# Altium schematic sheet Voltage detect.SchDoc
size A4; ENG_APP_DATE: --/--/--; DSN_APP_DATE: --/--/--; CHK_APP_DATE: --/--/--
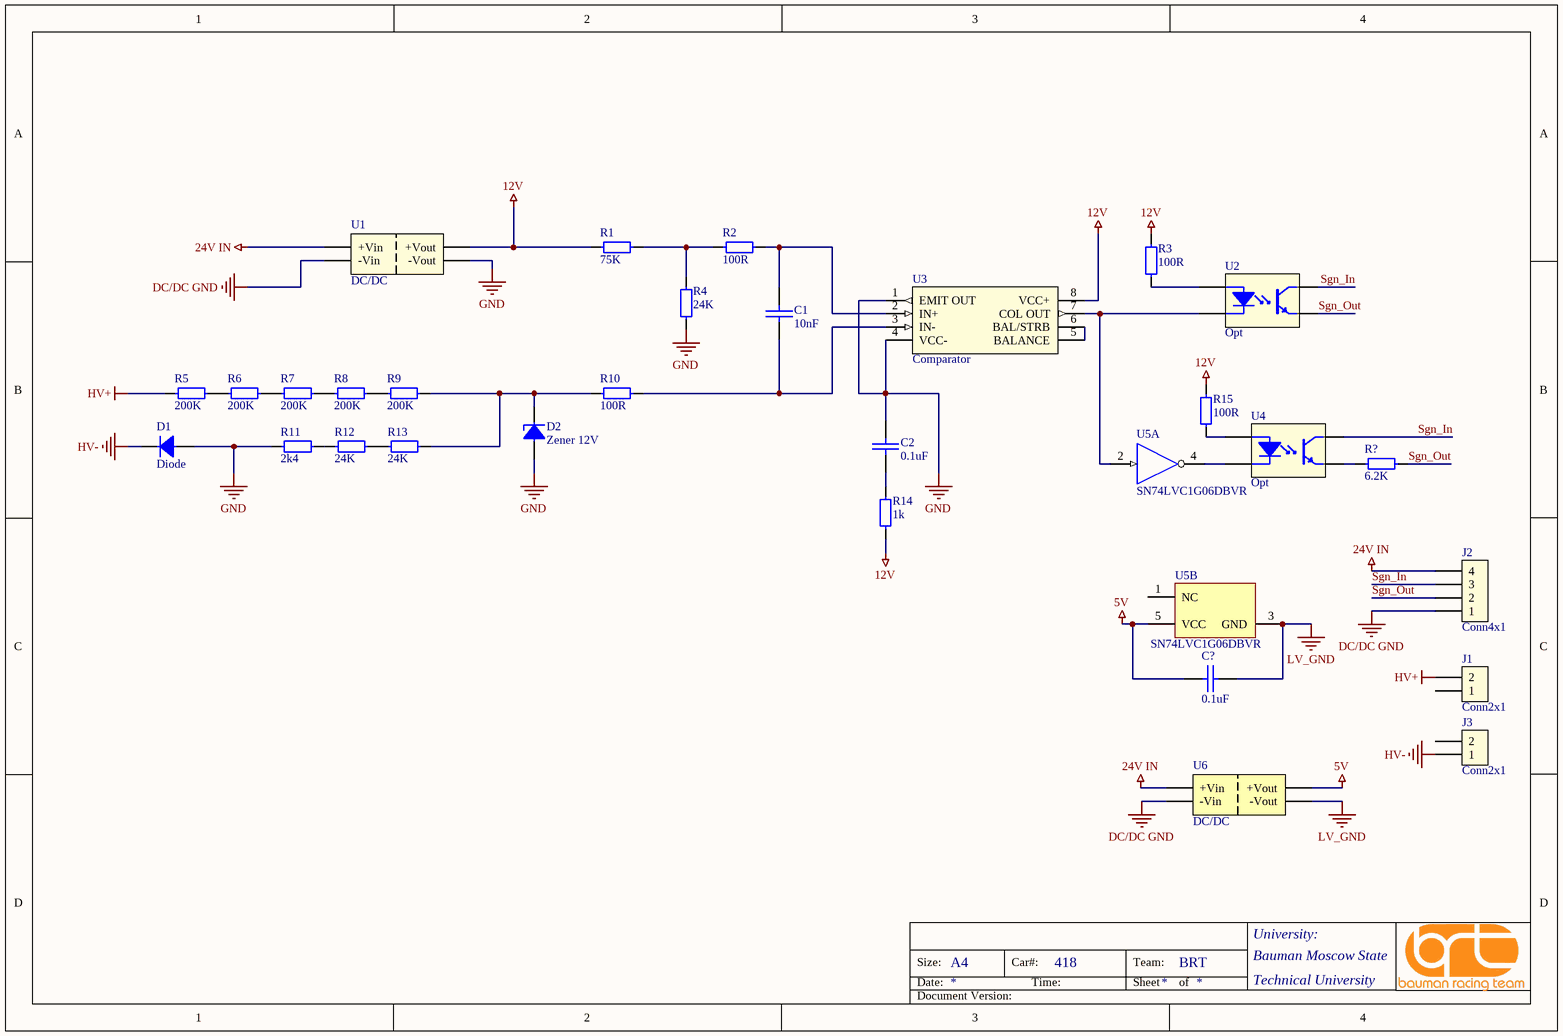
[diagram p0: Voltage detect.SchDoc]

## Parts
C1  10nF  [0805 Capicator]
C2  0.1uF  [0805 Capicator]
C?  0.1uF  [0805 Capicator]
D1  Diode  [BY12]
D2  Zener 12V  [sod-323]
J1  Conn2x1  [MolexMicroFit 2x1]
J2  Conn4x1  [MolexMicroFit 4x1]
J3  Conn2x1  [MolexMicroFit 2x1]
R1  75K  [0805 Resistor]
R2  100R  [0805 Resistor]
R3  100R  [0805 Resistor]
R4  24K  [0805 Resistor]
R5  200K  [0805 Resistor]
R6  200K  [0805 Resistor]
R7  200K  [0805 Resistor]
R8  200K  [0805 Resistor]
R9  200K  [0805 Resistor]
R10  100R  [0805 Resistor]
R11  2k4  [0805 Resistor]
R12  24K  [0805 Resistor]
R13  24K  [0805 Resistor]
R14  1k  [0805 Resistor]
R15  100R  [0805 Resistor]
R?  6.2K  [0603 RESISTOR]
U1  DC/DC  [SIP7]
U2  Opt  [FAIR-MDIP-4_V]
U3  Comparator  [SO-8]
U4  Opt  [FAIR-MDIP-4_V]
U5  SN74LVC1G06DBVR  [DBV0005A_N]  (parts A,B of 2)
U6  DC/DC  [SIP7]

## Nets
5V: C?.1 U5.5(VCC) U6.6(+Vout)
12V: R1.1 R3.2 R14.1 R15.2 U1.6(+Vout) U3.8(VCC+)
24V IN: J2.4 U1.1(+Vin) U6.1(+Vin)
DC/DC GND: J2.1 U1.2(-Vin) U6.2(-Vin)
GND: C2.2 D1.1 D2.1 R4.1 R11.1 U1.4(-Vout) U3.1(EMIT_OUT) U3.4(VCC-)
HV+: J1.2 R5.1
HV-: D1.2 J3.1
LV_GND: C?.2 U5.3(GND) U6.4(-Vout)
Sgn_In: J2.3 U2.4(COLLECTOR) U4.4(COLLECTOR)
Sgn_Out: J2.2 R?.2 U2.3(EMITTER)
NetC1_1: C1.1 R10.2 U3.3(IN-)
NetC1_2: C1.2 R2.2 U3.2(IN+)
NetC2_1: C2.1 R14.2
NetD2_2: D2.2 R9.2 R10.1 R13.2
NetR1_2: R1.2 R2.1 R4.2
NetR3_1: R3.1 U2.1(ANODE)
NetR5_2: R5.2 R6.1
NetR6_2: R6.2 R7.1
NetR7_2: R7.2 R8.1
NetR8_2: R8.2 R9.1
NetR11_2: R11.2 R12.2
NetR12_1: R12.1 R13.1
NetR15_1: R15.1 U4.1(ANODE)
NetR?_1: R?.1 U4.3(EMITTER)
NetU2_2: U2.2(CATHODE) U3.7(COL_OUT) U5.2(A)
NetU3_5: U3.5(BALANCE) U3.6(BAL/STRB)
NetU4_2: U4.2(CATHODE) U5.4(Y)

Not connected (* = marked no-connect by the designer): J1 1; J3 2; U5 1(NC)

## Notes on the sheet
- Size:
- Date:
- A4
- Car#:
- Time:
- 418
- Team:
- Sheet
- BRT
- of
- University:
- Technical University
- Bauman Moscow State
- Document Version:

## Library data of the parts
C1 = Cap 10nF (0805): 0805 X7R 10nF 100V 10%; Manufacturer: Murata Manufacturing; Part Number: GRM21BR72A103KA01L; Type: Capacitor; ComponentLink1Description: Chip&Dip; ComponentLink1URL: https://www.chipdip.ru/product/grm21br72a103ka01l
C2 = Cap 0.1uF (0805): 0.1uF X7R 50V 10% 0805; Manufacturer: Murata Manufacturing; Part Number: GRM21BR71H104K; Type: Capacitor; ComponentLink1Description: Chip&Dip; ComponentLink1URL: https://www.chipdip.ru/product/grm21br71h104k
C? = Cap 0.1uF (0805): 0.1uF X7R 50V 10% 0805; Manufacturer: Murata Manufacturing; Part Number: GRM21BR71E104KA01L; Type: Capacitor; ComponentLink1Description: Chip&Dip; ComponentLink1URL: https://www.chipdip.ru/product/grm21br71e104ka01l
D1 = BY12: BY12 - Highg voltage diode; ComponentLink1Description: ChipDip; ComponentLink1URL: https://www.chipdip.ru/product/by12; ComponentLink2Description: Datasheet; ComponentLink2URL: https://static.chipdip.ru/lib/508/DOC001508556.pdf
D2 = Zener Diode 12V: 300mW; Part Number: BZX384-C12,115; Manufacturer: NXP Semiconductor; Type: Diode; ComponentLink1Description: Chip&Dip; ComponentLink1URL: https://www.chipdip.ru/product/bzx384-c12.115; ComponentLink2Description: DataSheet; ComponentLink2URL: https://static.chipdip.ru/lib/583/DOC001583013.pdf
J1 J3 = Conn2x1 [MicroFit]: Micro-Fit 3.0 Right-Angle Header, 3.00mm Pitch, Single Row, 2 Circuits, with Snap-in Plastic Peg PCB Lock, Tin, Glow-Wire Capable, Black; Part Number: 436500200; Manufacturer: Molex; ComponentLink1Description: Molex; ComponentLink1URL: https://www.molex.com/molex/products/part-detail/pcb_headers/0436500200; Type: Connector
J2 = Conn4x1 [MicroFit]: Micro-Fit 3.0 Right-Angle Header, 3.00mm Pitch, Single Row, 4 Circuits, with Snap-in Plastic Peg PCB Lock, Tin, Glow-Wire Capable, Black; Part Number: 436500400; Manufacturer: Molex; ComponentLink1Description: Molex; ComponentLink1URL: https://www.molex.com/molex/products/part-detail/pcb_headers/0436500400; Type: Connector
R1 = Res 75K (0805): 0.125W 0805 75K, 1%; Part Number: RC0805FR-0775KL; Manufacturer: Taiwan; Type: Resistor; ComponentLink1Description: Chip&Dip; ComponentLink1URL: https://www.chipdip.ru/product0/9000079535
R2 R3 R10 R15 = Res 100R (0805): 0.125W 0805 100R, 1%; Part Number: RC0805FR-07100RL; Manufacturer: Taiwan; Type: Resistor; ComponentLink1Description: Chip&Dip; ComponentLink1URL: https://www.chipdip.ru/product0/9000079462
R4 R12 R13 = Res 24K (0805): 0.125W 0805 24K, 1%; Part Number: RC0805FR-0724KL; Manufacturer: Taiwan; Type: Resistor; ComponentLink1Description: Chip&Dip; ComponentLink1URL: https://www.chipdip.ru/product0/9000079523
R5-R9 = Res 200K (0805): 0.125W 0805 200K, 1%; Part Number: RC0805FK-07200KL; Manufacturer: Taiwan; Type: Resistor; ComponentLink1Description: Chip&Dip; ComponentLink1URL: https://www.chipdip.ru/product0/914213016
R11 = Res 2.4k (0805): 0.125W 0805 2.4k, 1%; Part Number: RC0805FR-072K4L; Manufacturer: Taiwan; Type: Resistor; ComponentLink1Description: Chip&Dip; ComponentLink1URL: https://www.chipdip.ru/product0/9000079495
R14 = Res 1k (0805): 0.125W 0805 1k, 1%; Part Number: RC0805FR-071KL; Manufacturer: Taiwan; Type: Resistor; ComponentLink1Description: Chip&Dip; ComponentLink1URL: https://www.chipdip.ru/product0/9000079486
R? = Res 6.2K: 0.1W 0603 6.2K, 1%; Part Number: RC0603FR-076K2L; Manufacturer: Taiwan; ComponentLink1Description: Chip&Dip; ComponentLink1URL: https://www.chipdip.ru/product0/9000079731; Type: Resistor
U1 = DC/DC Isolated [TMH]: The TMH series are ultra miniature, isolated 2 Watt DC/DC-converters in a Single-in-Line  package  (SIP); ComponentLink1Description: Chip&Dip; ComponentLink1URL: https://www.chipdip.ru/product/tmh-1205s; ComponentLink2Description: New link; ComponentLink2URL: https://static.chipdip.ru/lib/005/DOC001005854.pdf
U2 U4 = Optocoupler [FOD817B]: Phototransistor Optocoupler, 4 us Rise, 3 us Fall, 5000 Vrms, -55 to 110 degC, 4-Pin MDIP, RoHS, Tape and Reel; Manufacturer: ON Semiconductor; Part Nomber: FOD817B; ComponentLink1Description: CHIPDIP; ComponentLink1URL: https://www.chipdip.ru/product/fod817b; ComponentLink2Description: Datasheet; ComponentLink2URL: https://static.chipdip.ru/lib/297/DOC000297284.pdf
U3 = Comparator [LM3]: Differential comparator with strobes; Part Number: LM311DR; Manufacturer: Texas Instruments; ComponentLink1Description: DataSheet; ComponentLink1URL: https://static.chipdip.ru/lib/222/DOC000222396.pdf; ComponentLink2Description: Chip&Dip; ComponentLink2URL: https://www.chipdip.ru/product/lm311d; Type: IC
U5 = CMP-0859-00128-3: Single Inverter Buffer/Driver With Open-Drain Output, DBV0005A, LARGE T&R; Manufacturer: Texas Instruments; VCC(Min)(V): 1.65; ICC @ Nom Voltage(Max)(mA): 0.01; Rating: Catalog; Output Type: CMOS; Schmitt Trigger: No; Logic: Inverting; Input Type: CMOS/TTL; Bits(#): 1; Voltage(Nom)(V): 1.8,2.5,3.3,5; F @ Nom Voltage(Max)(Mhz): 150; Technology Family: LVC; Output Drive (IOL/IOH)(Max)(mA): 32/-32; VCC(Max)(V): 5.5; tpd @ Nom Voltage(Max)(ns): 6.5,4,3; Sub-Family: Inverting Buffer/Driver; PackageReference: DBV0005A; Operating Temperature Range(C): -40 to 125,-40 to 85; Generic Part Number: SN74LVC1G06; 3-State Output: No; DatasheetVersion: SCES295W
U6 = DC/DC Isolated 5V [TMH]: The TMH series are ultra miniature, isolated 2 Watt DC/DC-converters in a Single-in-Line  package  (SIP); Manufacturer: Traco Power; Part Number: TMH1205S; ComponentLink1Description: Chip&Dip; ComponentLink1URL: https://www.chipdip.ru/product/tmh-1205s; ComponentLink2Description: DataSheet; ComponentLink2URL: https://static.chipdip.ru/lib/005/DOC001005854.pdf; Type: IC